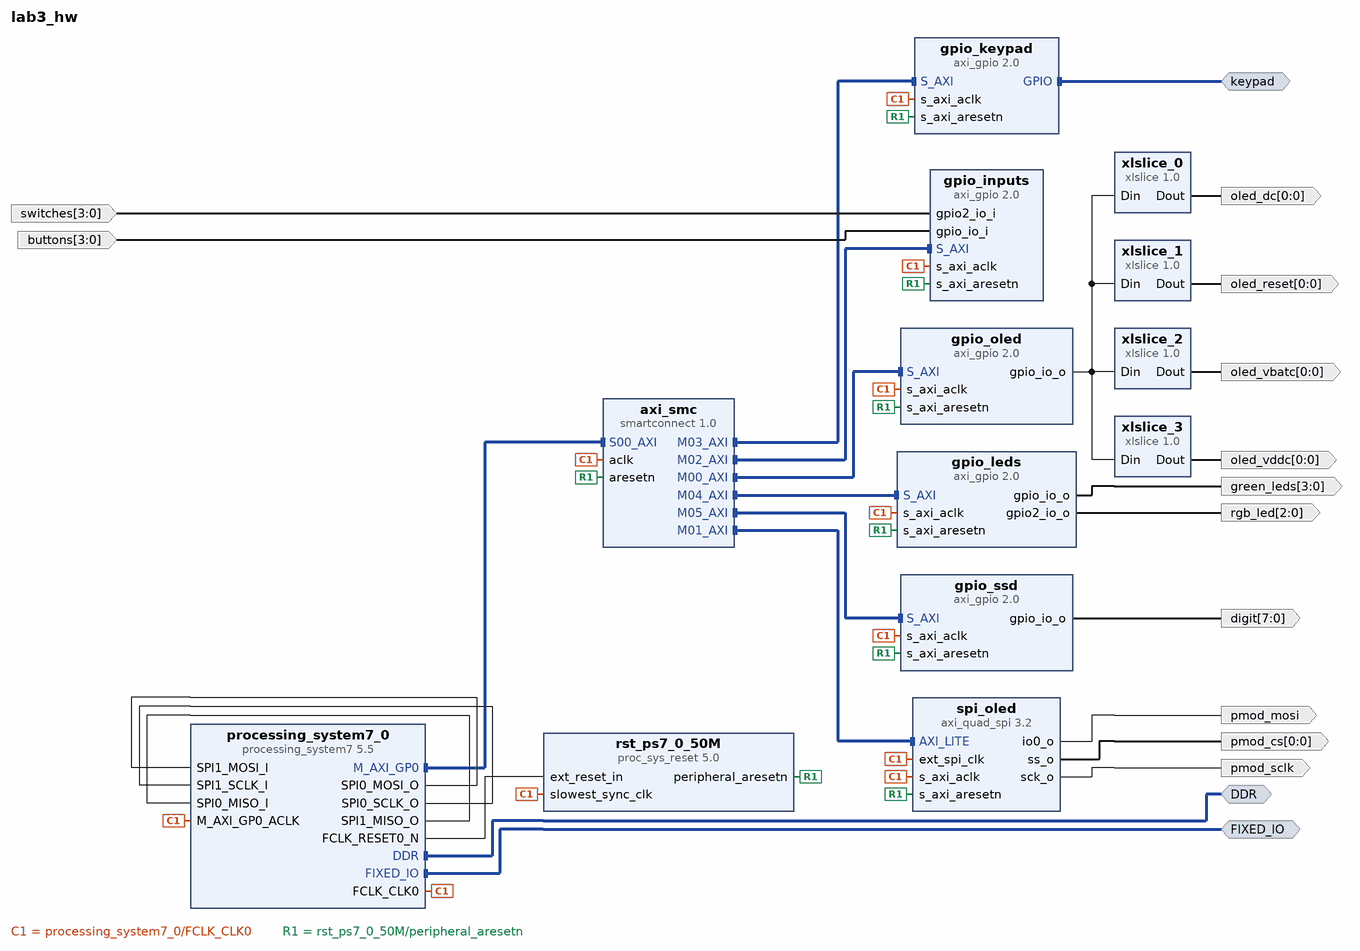
[diagram p0: block diagram of the top level]
# Vivado block design lab3_hw, xc7z010clg400-1, Vivado 2024.2
create_bd_design lab3_hw

create_bd_intf_port -mode Master -vlnv xilinx.com:interface:ddrx_rtl:1.0 DDR
create_bd_intf_port -mode Master -vlnv xilinx.com:display_processing_system7:fixedio_rtl:1.0 FIXED_IO
create_bd_intf_port -mode Master -vlnv xilinx.com:interface:gpio_rtl:1.0 keypad
create_bd_port -dir O pmod_mosi
create_bd_port -dir O pmod_sclk
create_bd_port -dir O -from 0 -to 0 pmod_cs
create_bd_port -dir O -from 0 -to 0 oled_dc
create_bd_port -dir O -from 0 -to 0 oled_reset
create_bd_port -dir O -from 0 -to 0 oled_vbatc
create_bd_port -dir O -from 0 -to 0 oled_vddc
create_bd_port -dir I -from 3 -to 0 buttons
create_bd_port -dir I -from 3 -to 0 switches
create_bd_port -dir O -from 3 -to 0 green_leds
create_bd_port -dir O -from 2 -to 0 rgb_led
create_bd_port -dir O -from 7 -to 0 digit

create_bd_cell -type ip -vlnv xilinx.com:ip:processing_system7:5.5 processing_system7_0
set_property -dict [list \
  CONFIG.PCW_APU_PERIPHERAL_FREQMHZ 667 \
  CONFIG.PCW_ENET0_ENET0_IO {MIO 16 .. 27} \
  CONFIG.PCW_ENET0_GRP_MDIO_ENABLE 1 \
  CONFIG.PCW_ENET0_GRP_MDIO_IO {MIO 52 .. 53} \
  CONFIG.PCW_ENET0_PERIPHERAL_ENABLE 1 \
  CONFIG.PCW_ENET0_RESET_ENABLE 0 \
  CONFIG.PCW_ENET_RESET_ENABLE 1 \
  CONFIG.PCW_ENET_RESET_SELECT {Share reset pin} \
  CONFIG.PCW_GPIO_MIO_GPIO_ENABLE 1 \
  CONFIG.PCW_GPIO_MIO_GPIO_IO MIO \
  CONFIG.PCW_I2C_RESET_ENABLE 1 \
  CONFIG.PCW_PRESET_BANK1_VOLTAGE {LVCMOS 1.8V} \
  CONFIG.PCW_QSPI_GRP_FBCLK_ENABLE 1 \
  CONFIG.PCW_QSPI_GRP_FBCLK_IO {MIO 8} \
  CONFIG.PCW_QSPI_GRP_SINGLE_SS_ENABLE 1 \
  CONFIG.PCW_QSPI_GRP_SINGLE_SS_IO {MIO 1 .. 6} \
  CONFIG.PCW_QSPI_PERIPHERAL_ENABLE 1 \
  CONFIG.PCW_QSPI_QSPI_IO {MIO 1 .. 6} \
  CONFIG.PCW_SD0_GRP_CD_ENABLE 1 \
  CONFIG.PCW_SD0_GRP_CD_IO {MIO 47} \
  CONFIG.PCW_SD0_GRP_WP_ENABLE 0 \
  CONFIG.PCW_SD0_PERIPHERAL_ENABLE 1 \
  CONFIG.PCW_SD0_SD0_IO {MIO 40 .. 45} \
  CONFIG.PCW_SDIO_PERIPHERAL_FREQMHZ 50 \
  CONFIG.PCW_SINGLE_QSPI_DATA_MODE x4 \
  CONFIG.PCW_SPI0_PERIPHERAL_ENABLE 1 \
  CONFIG.PCW_SPI0_SPI0_IO EMIO \
  CONFIG.PCW_SPI1_PERIPHERAL_ENABLE 1 \
  CONFIG.PCW_SPI1_SPI1_IO EMIO \
  CONFIG.PCW_TTC0_PERIPHERAL_ENABLE 1 \
  CONFIG.PCW_TTC0_TTC0_IO EMIO \
  CONFIG.PCW_UART1_PERIPHERAL_ENABLE 1 \
  CONFIG.PCW_UART1_UART1_IO {MIO 48 .. 49} \
  CONFIG.PCW_UART_PERIPHERAL_FREQMHZ 100 \
  CONFIG.PCW_UIPARAM_DDR_FREQ_MHZ 533.333333 \
  CONFIG.PCW_UIPARAM_DDR_MEMORY_TYPE {DDR 3 (Low Voltage)} \
  CONFIG.PCW_UIPARAM_DDR_PARTNO {MT41K256M16 RE-125} \
  CONFIG.PCW_USB0_PERIPHERAL_ENABLE 1 \
  CONFIG.PCW_USB0_RESET_ENABLE 1 \
  CONFIG.PCW_USB0_RESET_IO {MIO 46} \
  CONFIG.PCW_USB0_USB0_IO {MIO 28 .. 39} \
  CONFIG.PCW_USB_RESET_ENABLE 1 \
  CONFIG.PCW_USB_RESET_SELECT {Share reset pin} \
] [get_bd_cells processing_system7_0]
# 305 more settings of processing_system7_0 are not shown: defaults, MIO pin electricals, DDR timing, and values the tool derives
create_bd_cell -type ip -vlnv xilinx.com:ip:axi_gpio:2.0 gpio_oled
set_property -dict [list \
  CONFIG.C_ALL_INPUTS 0 \
  CONFIG.C_ALL_OUTPUTS 1 \
  CONFIG.C_GPIO_WIDTH 4 \
  CONFIG.GPIO_BOARD_INTERFACE Custom \
  CONFIG.USE_BOARD_FLOW true \
] [get_bd_cells gpio_oled]
create_bd_cell -type ip -vlnv xilinx.com:ip:smartconnect:1.0 axi_smc
set_property -dict {CONFIG.NUM_MI 6 CONFIG.NUM_SI 1} [get_bd_cells axi_smc]
create_bd_cell -type ip -vlnv xilinx.com:ip:proc_sys_reset:5.0 rst_ps7_0_50M
create_bd_cell -type ip -vlnv xilinx.com:ip:xlslice:1.0 xlslice_0
set_property -dict {CONFIG.DIN_WIDTH 4} [get_bd_cells xlslice_0]
create_bd_cell -type ip -vlnv xilinx.com:ip:xlslice:1.0 xlslice_1
set_property -dict {CONFIG.DIN_FROM 1 CONFIG.DIN_TO 1 CONFIG.DIN_WIDTH 4} [get_bd_cells xlslice_1]
create_bd_cell -type ip -vlnv xilinx.com:ip:xlslice:1.0 xlslice_2
set_property -dict {CONFIG.DIN_FROM 2 CONFIG.DIN_TO 2 CONFIG.DIN_WIDTH 4} [get_bd_cells xlslice_2]
create_bd_cell -type ip -vlnv xilinx.com:ip:xlslice:1.0 xlslice_3
set_property -dict {CONFIG.DIN_FROM 3 CONFIG.DIN_TO 3 CONFIG.DIN_WIDTH 4} [get_bd_cells xlslice_3]
create_bd_cell -type ip -vlnv xilinx.com:ip:axi_quad_spi:3.2 spi_oled
set_property -dict {CONFIG.Async_Clk 1 CONFIG.C_TYPE_OF_AXI4_INTERFACE 0 CONFIG.C_USE_STARTUP 0} [get_bd_cells spi_oled]
create_bd_cell -type ip -vlnv xilinx.com:ip:axi_gpio:2.0 gpio_inputs
set_property -dict [list \
  CONFIG.GPIO2_BOARD_INTERFACE sws_4bits \
  CONFIG.GPIO_BOARD_INTERFACE btns_4bits \
  CONFIG.USE_BOARD_FLOW true \
] [get_bd_cells gpio_inputs]
create_bd_cell -type ip -vlnv xilinx.com:ip:axi_gpio:2.0 gpio_keypad
set_property -dict {CONFIG.C_ALL_OUTPUTS 0 CONFIG.C_GPIO_WIDTH 8} [get_bd_cells gpio_keypad]
create_bd_cell -type ip -vlnv xilinx.com:ip:axi_gpio:2.0 gpio_ssd
set_property -dict {CONFIG.C_ALL_OUTPUTS 1 CONFIG.C_GPIO_WIDTH 8} [get_bd_cells gpio_ssd]
create_bd_cell -type ip -vlnv xilinx.com:ip:axi_gpio:2.0 gpio_leds
set_property -dict [list \
  CONFIG.C_ALL_OUTPUTS 1 \
  CONFIG.C_ALL_OUTPUTS_2 1 \
  CONFIG.C_GPIO2_WIDTH 3 \
  CONFIG.C_GPIO_WIDTH 4 \
  CONFIG.C_IS_DUAL 1 \
] [get_bd_cells gpio_leds]

# ---- connections ----

connect_bd_intf_net [get_bd_intf_pins axi_smc/M00_AXI] [get_bd_intf_pins gpio_oled/S_AXI]
connect_bd_intf_net [get_bd_intf_pins axi_smc/M01_AXI] [get_bd_intf_pins spi_oled/AXI_LITE]
connect_bd_intf_net [get_bd_intf_pins axi_smc/M02_AXI] [get_bd_intf_pins gpio_inputs/S_AXI]
connect_bd_intf_net [get_bd_intf_pins axi_smc/M03_AXI] [get_bd_intf_pins gpio_keypad/S_AXI]
connect_bd_intf_net [get_bd_intf_pins axi_smc/M04_AXI] [get_bd_intf_pins gpio_leds/S_AXI]
connect_bd_intf_net [get_bd_intf_pins axi_smc/M05_AXI] [get_bd_intf_pins gpio_ssd/S_AXI]
connect_bd_intf_net [get_bd_intf_ports keypad] [get_bd_intf_pins gpio_keypad/GPIO]
connect_bd_intf_net [get_bd_intf_ports DDR] [get_bd_intf_pins processing_system7_0/DDR]
connect_bd_intf_net [get_bd_intf_ports FIXED_IO] [get_bd_intf_pins processing_system7_0/FIXED_IO]
connect_bd_intf_net [get_bd_intf_pins processing_system7_0/M_AXI_GP0] [get_bd_intf_pins axi_smc/S00_AXI]
connect_bd_net -net axi_gpio_0_gpio_io_o [get_bd_pins gpio_oled/gpio_io_o] \
  [get_bd_pins xlslice_0/Din] [get_bd_pins xlslice_1/Din] [get_bd_pins xlslice_2/Din] [get_bd_pins xlslice_3/Din]
connect_bd_net -net axi_quad_spi_0_io0_o [get_bd_pins spi_oled/io0_o] [get_bd_ports pmod_mosi]
connect_bd_net -net axi_quad_spi_0_sck_o [get_bd_pins spi_oled/sck_o] [get_bd_ports pmod_sclk]
connect_bd_net -net axi_quad_spi_0_ss_o [get_bd_pins spi_oled/ss_o] [get_bd_ports pmod_cs]
connect_bd_net -net gpio2_io_i_0_1 [get_bd_ports switches] [get_bd_pins gpio_inputs/gpio2_io_i]
connect_bd_net -net gpio_io_i_0_1 [get_bd_ports buttons] [get_bd_pins gpio_inputs/gpio_io_i]
connect_bd_net [get_bd_pins gpio_leds/gpio2_io_o] [get_bd_ports rgb_led]
connect_bd_net [get_bd_pins gpio_leds/gpio_io_o] [get_bd_ports green_leds]
connect_bd_net [get_bd_pins gpio_ssd/gpio_io_o] [get_bd_ports digit]
connect_bd_net [get_bd_pins processing_system7_0/FCLK_CLK0] \
  [get_bd_pins processing_system7_0/M_AXI_GP0_ACLK] [get_bd_pins axi_smc/aclk] [get_bd_pins gpio_oled/s_axi_aclk] \
  [get_bd_pins rst_ps7_0_50M/slowest_sync_clk] [get_bd_pins spi_oled/s_axi_aclk] [get_bd_pins spi_oled/ext_spi_clk] \
  [get_bd_pins gpio_inputs/s_axi_aclk] [get_bd_pins gpio_keypad/s_axi_aclk] [get_bd_pins gpio_leds/s_axi_aclk] \
  [get_bd_pins gpio_ssd/s_axi_aclk]
connect_bd_net [get_bd_pins processing_system7_0/FCLK_RESET0_N] [get_bd_pins rst_ps7_0_50M/ext_reset_in]
connect_bd_net [get_bd_pins processing_system7_0/SPI0_MOSI_O] [get_bd_pins processing_system7_0/SPI1_MOSI_I]
connect_bd_net [get_bd_pins processing_system7_0/SPI0_SCLK_O] [get_bd_pins processing_system7_0/SPI1_SCLK_I]
connect_bd_net [get_bd_pins processing_system7_0/SPI1_MISO_O] [get_bd_pins processing_system7_0/SPI0_MISO_I]
connect_bd_net [get_bd_pins rst_ps7_0_50M/peripheral_aresetn] \
  [get_bd_pins gpio_oled/s_axi_aresetn] [get_bd_pins axi_smc/aresetn] [get_bd_pins spi_oled/s_axi_aresetn] \
  [get_bd_pins gpio_inputs/s_axi_aresetn] [get_bd_pins gpio_keypad/s_axi_aresetn] [get_bd_pins gpio_leds/s_axi_aresetn] \
  [get_bd_pins gpio_ssd/s_axi_aresetn]
connect_bd_net [get_bd_pins xlslice_0/Dout] [get_bd_ports oled_dc]
connect_bd_net [get_bd_pins xlslice_1/Dout] [get_bd_ports oled_reset]
connect_bd_net [get_bd_pins xlslice_2/Dout] [get_bd_ports oled_vbatc]
connect_bd_net [get_bd_pins xlslice_3/Dout] [get_bd_ports oled_vddc]

# ---- address map ----
assign_bd_address -offset 0x41200000 -range 64K -target_address_space [get_bd_addr_spaces processing_system7_0/Data] [get_bd_addr_segs gpio_oled/S_AXI/Reg]
assign_bd_address -offset 0x41210000 -range 64K -target_address_space [get_bd_addr_spaces processing_system7_0/Data] [get_bd_addr_segs gpio_inputs/S_AXI/Reg]
assign_bd_address -offset 0x41220000 -range 64K -target_address_space [get_bd_addr_spaces processing_system7_0/Data] [get_bd_addr_segs gpio_keypad/S_AXI/Reg]
assign_bd_address -offset 0x41230000 -range 64K -target_address_space [get_bd_addr_spaces processing_system7_0/Data] [get_bd_addr_segs gpio_leds/S_AXI/Reg]
assign_bd_address -offset 0x41240000 -range 64K -target_address_space [get_bd_addr_spaces processing_system7_0/Data] [get_bd_addr_segs gpio_ssd/S_AXI/Reg]
assign_bd_address -offset 0x41E00000 -range 64K -target_address_space [get_bd_addr_spaces processing_system7_0/Data] [get_bd_addr_segs spi_oled/AXI_LITE/Reg]

validate_bd_design
save_bd_design
